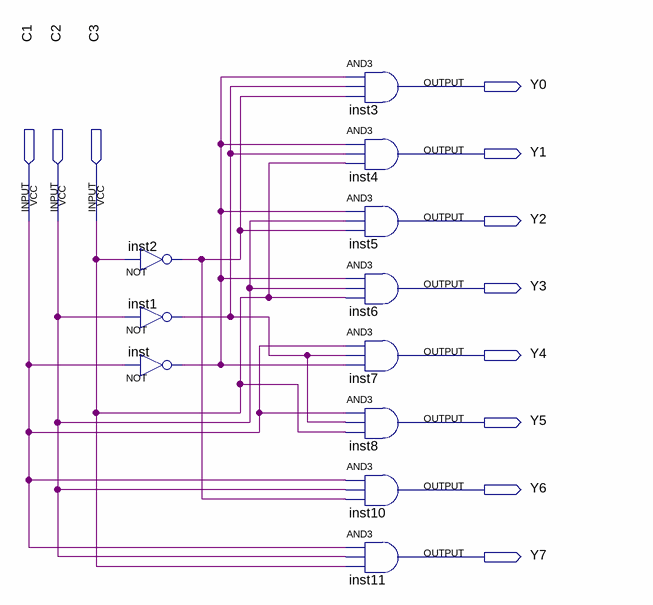
[diagram p0: schematic sheet]
// Quartus schematic decoder_3x8.bdf as structural Verilog: 11 symbols, 11 pins
module decoder_3x8 (
  input  C1,
  input  C2,
  input  C3,
  output Y0,
  output Y1,
  output Y2,
  output Y3,
  output Y4,
  output Y5,
  output Y6,
  output Y7
);

  wire inst1_out, inst2_out, inst_out;

  not inst2 (inst2_out, C3);
  not inst1 (inst1_out, C2);
  not inst (inst_out, C1);
  and inst3 (Y0, inst_out, inst1_out, inst2_out);
  and inst4 (Y1, inst_out, inst1_out, C3);
  and inst5 (Y2, inst_out, C2, inst2_out);
  and inst6 (Y3, inst_out, C2, C3);
  and inst7 (Y4, C1, inst1_out, inst_out);
  and inst8 (Y5, C1, inst1_out, C3);
  and inst10 (Y6, C1, C2, inst2_out);
  and inst11 (Y7, C1, C2, C3);
endmodule
